# EAGLE design DMX (EAGLE 5.10)
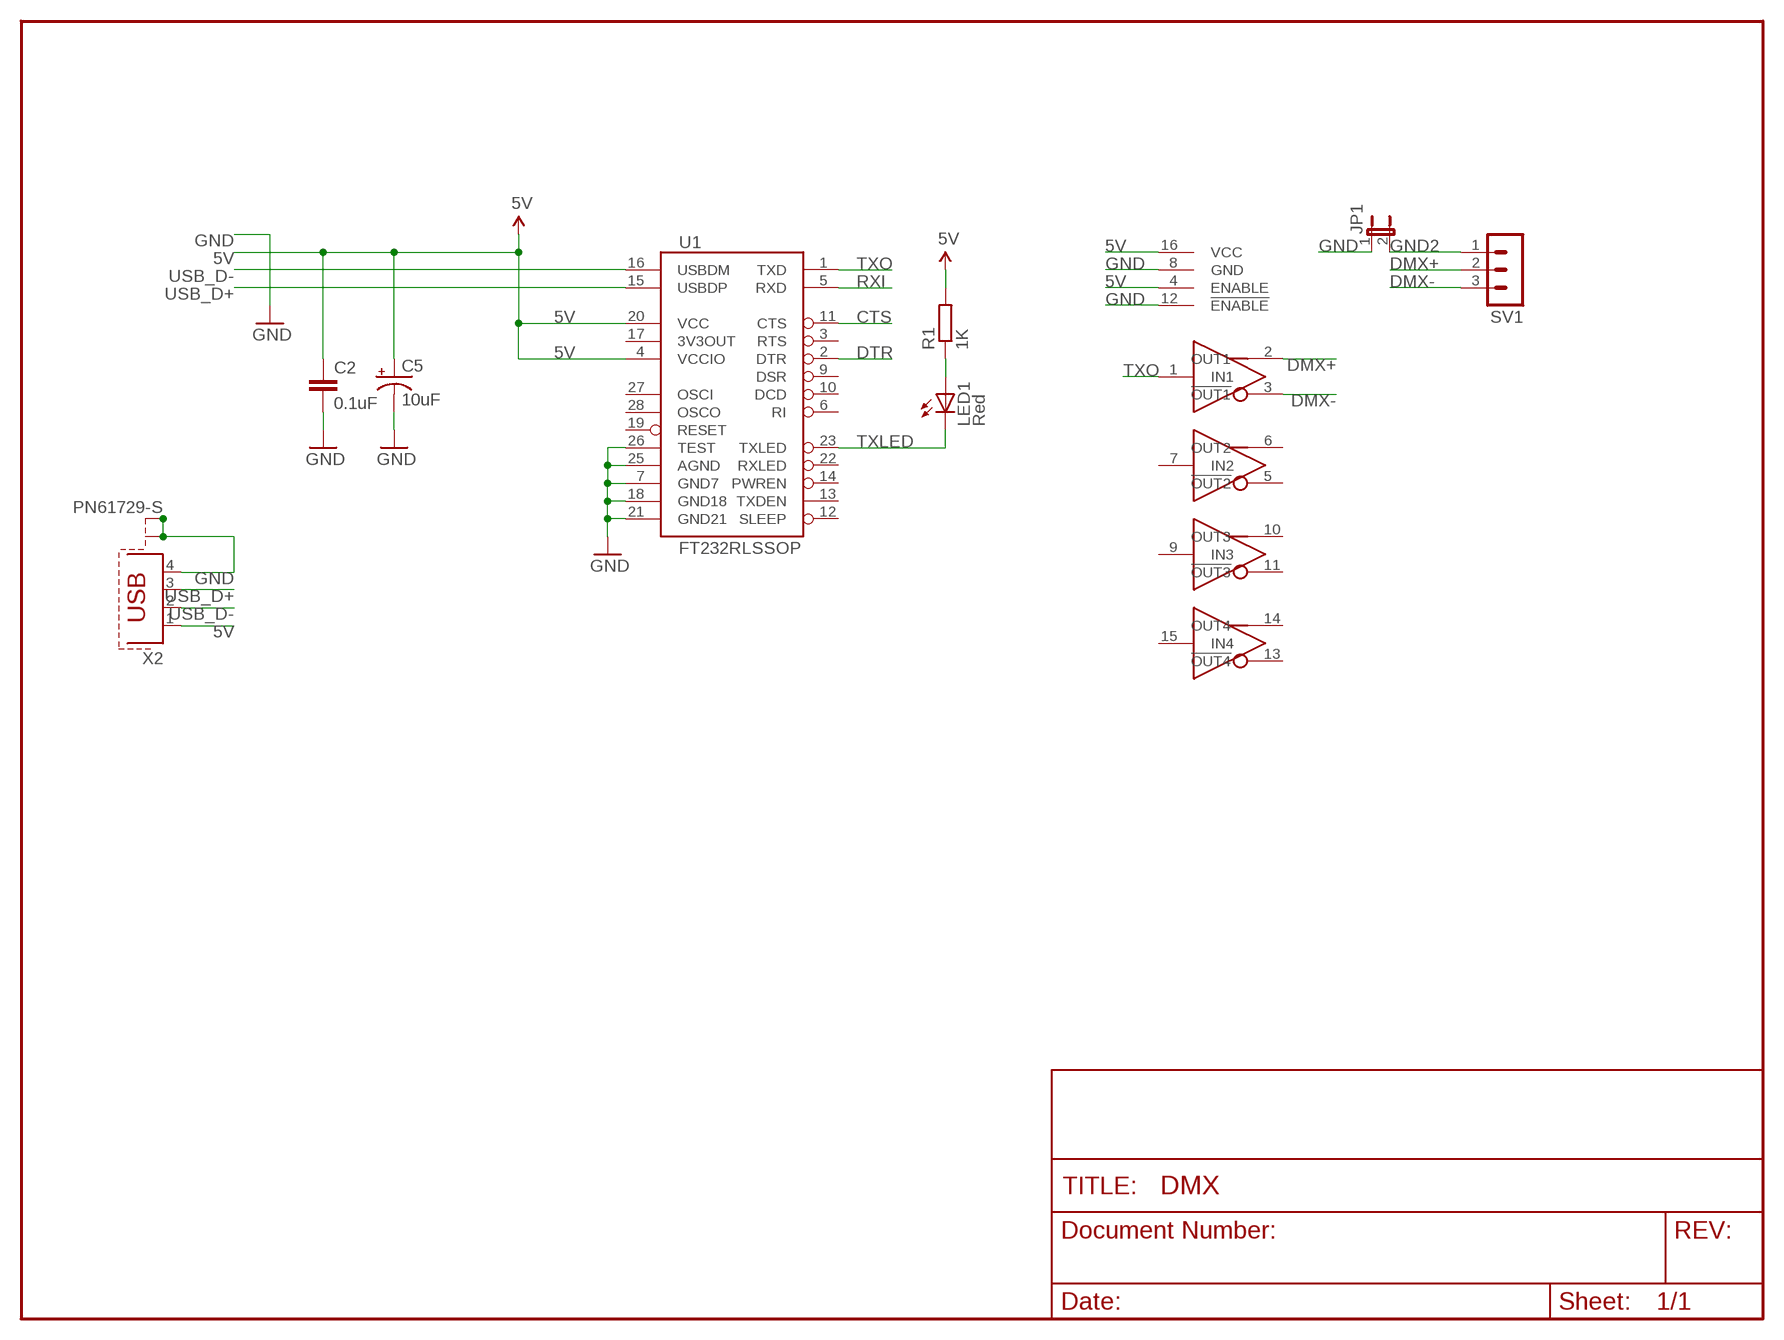
[diagram p0: schematic, sheet 1]

## Parts
C2  0.1uF  CAP0402-CAP  [0402-CAP]
C5  10uF  CAP_POL1206  [EIA3216]
JP1  JP1E  [JP1]
LED1  Red  LED3MM  [LED3MM]
R1  1K  R-EU_R0805  [R0805]
SV1  MA03-1  [MA03-1]
U1  FT232RLSSOP  [SSOP28DB]
U$5  26C31  [DIL16]
X2  PN61729-S  [PN61729-S]

## Nets
5V: C2.1 C5.A(+) R1.2 U1.4(VCCIO) U1.20(VCC) U$5.4(ENABLE) U$5.16(VCC) X2.1
CTS: U1.11(CTS)
DMX+: SV1.2 U$5.2(OUT1)
DMX-: SV1.3 U$5.3(!OUT1)
DTR: U1.2(DTR)
GND [power]: C2.2 C5.C(-) JP1.1 U1.7(GND7) U1.18(GND18) U1.21(GND21) U1.25(AGND) U1.26(TEST) U$5.8(GND) U$5.12(!ENABLE) X2.4 X2.S1 X2.S2
GND2: JP1.2 SV1.1
N$1: LED1.A R1.1
RXI: U1.5(RXD)
TXLED: LED1.K(C) U1.23(TXLED)
TXO: U1.1(TXD) U$5.1(IN1)
USB_D+: U1.15(USBDP) X2.3
USB_D-: U1.16(USBDM) X2.2
Unconnected: U1.3(RTS) U1.6(RI) U1.9(DSR) U1.10(DCD) U1.12(SLEEP) U1.13(TXDEN) U1.14(PWREN) U1.17(3V3OUT) U1.19(RESET) U1.22(RXLED) U1.27(OSCI) U1.28(OSCO) U$5.5(!OUT2) U$5.6(OUT2) U$5.7(IN2) U$5.9(IN3) U$5.10(OUT3) U$5.11(!OUT3) U$5.13(!OUT4) U$5.14(OUT4) U$5.15(IN4)

## Library data of the parts
C2 = SparkFun:CAP: Capacitor Standard 0603 ceramic capacitor, and 0.1" leaded capacitor.
C5 = SparkFun:CAP_POL: Capacitor Polarized These are standard SMD and PTH capacitors. Normally 10uF, 47uF, and 100uF in electrolytic and tantalum varieties. Always verify the external diameter of the through hole cap, it varies with capacity, voltage, and manufacturer. The EIA devices should be standard.
JP1 = jumper:JP1E: JUMPER
LED1 = led:LED: LED OSRAM: - CHIPLED LG R971, LG N971, LY N971, LG Q971, LY Q971, LO R971, LY R971 LH N974, LH R974 LS Q976, LO Q976, LY Q976 LO Q996 - Hyper CHIPLED LW Q18S LB Q993, LB Q99A, LB R99A - SideLED LS A670, LO A670, LY A670, LG A670, LP A670 LB A673, LV A673, LT A673, LW A673 LH A674 LY A675 LS A676, LA A676, LO A676, LY A676, LW A676 LS A679, LY A679, LG A679 - Hyper Micro SIDELED® LS Y876, LA Y876, LO Y876, LY Y876 LT Y87S - SmartLED LW L88C, LW L88S LB L89C, LB L89S, LG L890 LS L89K, LO L89K, LY L89K LS L896, LA L896, LO L896, LY L896 - TOPLED LS T670, LO T670, LY T670, LG T670, LP T670 LSG T670, LSP T670, LSY T670, LOP T670, LYG T670 LG T671, LOG T671, LSG T671 LB T673, LV T673, LT T673, LW T673 LH T674 LS T676, LA T676, LO T676, LY T676, LB T676, LH T676, LSB T676, LW T676 LB T67C, LV T67C, LT T67C, LS T67K, LO T67K, LY T67K, LW E67C LS E67B, LA E67B, LO E67B, LY E67B, LB E67C, LV E67C, LT E67C LW T67C LS T679, LY T679, LG T679 LS T770, LO T770, LY T770, LG T770, LP T770 LB T773, LV T773, LT T773, LW T773 LH T774 LS E675, LA E675, LY E675, LS T675 LS T776, LA T776, LO T776, LY T776, LB T776 LHGB T686 LT T68C, LB T68C - Hyper Mini TOPLED® LB M676 - Mini TOPLED Santana® LG M470 LS M47K, LO M47K, LY M47K Source: http://www.osram.convergy.de LUXEON: - LUMILED® LXK2-PW12-R00, LXK2-PW12-S00, LXK2-PW14-U00, LXK2-PW14-V00 LXK2-PM12-R00, LXK2-PM12-S00, LXK2-PM14-U00 LXK2-PE12-Q00, LXK2-PE12-R00, LXK2-PE12-S00, LXK2-PE14-T00, LXK2-PE14-U00 LXK2-PB12-K00, LXK2-PB12-L00, LXK2-PB12-M00, LXK2-PB14-N00, LXK2-PB14-P00, LXK2-PB14-Q00 LXK2-PR12-L00, LXK2-PR12-M00, LXK2-PR14-Q00, LXK2-PR14-R00 LXK2-PD12-Q00, LXK2-PD12-R00, LXK2-PD12-S00 LXK2-PH12-R00, LXK2-PH12-S00 LXK2-PL12-P00, LXK2-PL12-Q00, LXK2-PL12-R00 Source: www.luxeon.com KINGBRIGHT: KA-3528ASYC Source: www.kingbright.com
R1 = rcl:R-EU_: RESISTOR, European symbol
SV1 = con-lstb:MA03-1: PIN HEADER
U1 = SparkFun:FT232RL: USB UART FT232RL 4th Generation USB UART (USB <-> Serial) Controller. Spark Fun Electronics SKU : COM-00650
U$5 = jocki:26C31
X2 = con-berg:PN61729-S: BERG USB connector

## Net classes
0 default: width 0.203 mm
1 power: width 0.254 mm

## Board
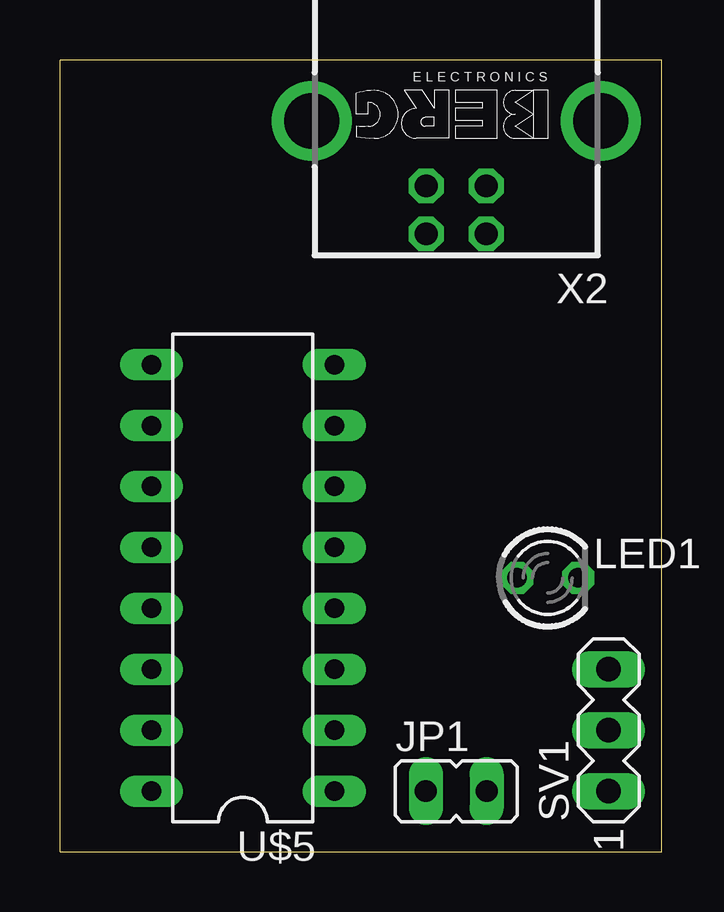
[diagram p1: board, top side]
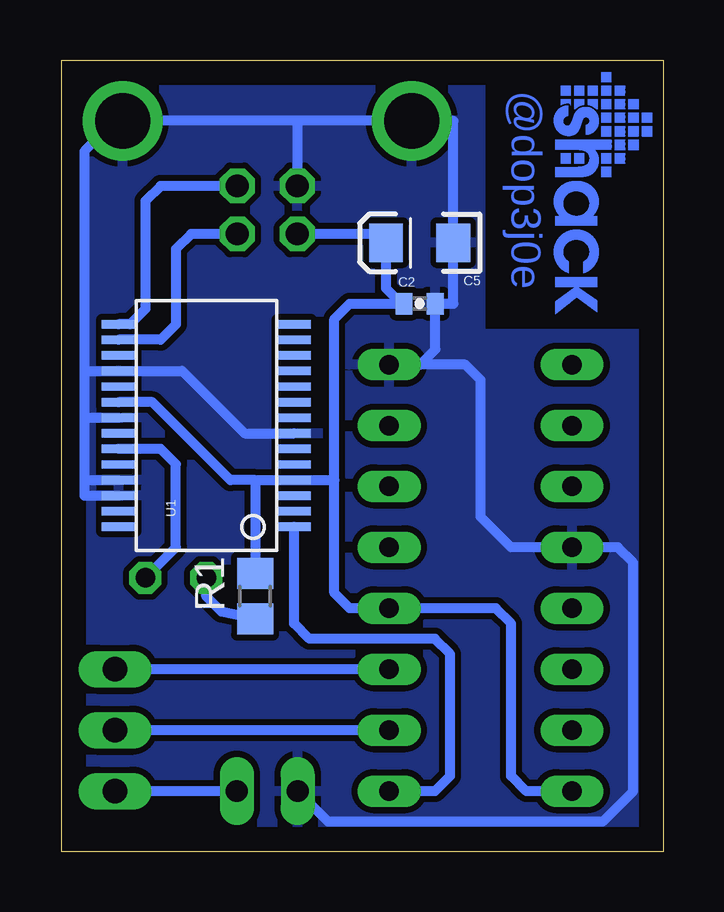
[diagram p2: board, bottom side, seen from below]

Size 25.07 x 33.02 mm. Coordinates in mm from the lower left corner, seen from the top.
Outline: 0,33.01 25.07,33.01 25.07,0 0,0 0,33.02
Copper layers (1*16): Top 0.035mm / dielectric 1.5mm / Bottom 0.035mm
Design rules "default": minimum track width 10mil, minimum drill 24mil, track to track 8mil, track to pad 8mil, pad to pad 8mil, via to via 8mil, smd to smd 8mil, copper to edge 40mil, drill to drill 8mil, minimum pad ring 10mil, minimum via ring 8mil, stop-mask expansion 4mil, vias tented up to drill 0mil, thermal gap 10mil

### Footprints (pad centres in the part's own frame; a part is rotated, then mirrored left to right if it is on the bottom)
0402-CAP = smd 0.7 x 0.9: 1 -0.65,0; 2 0.65,0
EIA3216 = smd 1.4 x 1.6: A 1.4,0; C -1.4,0
JP1 = drill 0.914 long: 1 0,-1.27; 2 0,1.27
LED3MM = drill 0.813 octagon: A -1.27,0; K 1.27,0
R0805 = smd 1.3 x 1.5: 1 -0.95,0; 2 0.95,0
MA03-1 = drill 1.016 long: 1 -2.54,0; 2 0,0; 3 2.54,0
SSOP28DB = smd 0.348 x 1.397: 1 -4.225,-3.656; 2 -3.575,-3.656; 3 -2.925,-3.656; 4 -2.275,-3.656; 5 -1.625,-3.656; 6 -0.975,-3.656; 7 -0.325,-3.656; 8 0.325,-3.656; 9 0.975,-3.656; 10 1.625,-3.656; 11 2.275,-3.656; 12 2.925,-3.656; 13 3.575,-3.656; 14 4.225,-3.656; 15 4.225,3.656; 16 3.575,3.656; 17 2.925,3.656; 18 2.275,3.656; 19 1.625,3.656; 20 0.975,3.656; 21 0.325,3.656; 22 -0.325,3.656; 23 -0.975,3.656; 24 -1.625,3.656; 25 -2.275,3.656; 26 -2.925,3.656; 27 -3.575,3.656; 28 -4.225,3.656
DIL16 = drill 0.813 long: 1 -7.62,-3.81; 2 -5.08,-3.81; 3 -2.54,-3.81; 4 0,-3.81; 5 2.54,-3.81; 6 5.08,-3.81; 7 7.62,-3.81; 8 10.16,-3.81; 9 10.16,3.81; 10 7.62,3.81; 11 5.08,3.81; 12 2.54,3.81; 13 0,3.81; 14 -2.54,3.81; 15 -5.08,3.81; 16 -7.62,3.81
PN61729-S = drill 0.95 octagon: 1 1.25,4.71; 2 -1.25,4.71; 3 -1.25,2.71; 4 1.25,2.71 | drill 2.3 pad 2.9 round: S1 -6.02,0; S2 6.02,0

### Placement (x,y rotation side)
C2  10.16,22.86 0 bottom
C5  10.16,25.4 180 bottom
JP1  16.51,2.54 270 top
LED1  20.32,11.43 0 top
R1  17.02,10.67 90 bottom
SV1  22.86,5.08 90 top
U1  19.05,17.78 90 bottom
U$2  [SHACK]  4.57,32.51 270 bottom
U$5  7.62,10.16 90 top
X2  16.51,30.48 180 top

### Tracks (layer width: path | path; a pad name or v marks a point on that pad's centre or on a via)
5V
  Bottom 0.406: X2.1 11.56,25.77 C5.A 11.56,23.5 10.93,22.86 | U$5.16 5.71,2.54 6.35,3.17 6.35,9.53 6.99,10.16 U$5.4 13.08,10.16 13.72,10.79 13.72,15.49 | 10.93,22.86 C2.1 | U1.20 21.3,18.75 18.05,15.51 17.02,15.51 17.02,15.49 | 10.93,22.86 13.08,22.86 13.72,22.23 13.72,15.49 | 17.02,15.49 R1.2 | 13.72,15.49 15.4,15.49 | 17.02,15.49 16.51,15.49 15.4,15.49 | 15.4,15.49 U1.4
DMX+
  Bottom 0.406: U$5.2 SV1.2
DMX-
  Bottom 0.406: U$5.3 SV1.3
GND
  Bottom 0.406: X2.S2 X2.S1 22.86,30.48 24.13,29.21 24.13,20.05 | X2.S2 15.26,30.48 X2.4 | X2.S2 8.76,30.48 C5.C 8.76,22.86 C2.2 9.51,20.95 10.14,20.32 U$5.8 8.26,20.32 7.62,19.68 7.62,13.97 6.35,12.7 U$5.12 1.91,12.7 1.27,12.06 1.27,2.54 2.54,1.27 13.97,1.27 JP1.1 | 24.13,20.05 24.13,18.11 | 24.13,18.11 U1.21 | U1.26 24.13,14.86 24.13,15.51 | 24.13,18.11 24.13,15.51 | 24.13,15.51 U1.25 | 24.13,20.05 U1.18 20.05,20.05 17.45,17.45 U1.7
  pour Bottom (isolate 0.254): 25.15,33.02 25.15,0 0,0 0,21.59 7.62,21.59 7.62,33.02
GND2
  Bottom 0.406: JP1.2 SV1.1
N$1
  Bottom 0.406: R1.1 18.41,10.02 19.05,10.65 LED1.A
TXLED
  Bottom 0.406: U1.23 20.95,16.8 20.32,16.17 20.32,12.7 LED1.K
TXO
  Bottom 0.406: U$5.1 9.53,2.54 8.89,3.17 8.89,8.26 9.53,8.89 14.76,8.89 15.39,9.53 U1.1
USB_D+
  Bottom 0.406: U1.15 22.23,22 21.59,22.64 21.59,27.14 20.95,27.77 X2.3
USB_D-
  Bottom 0.406: X2.2 19.68,25.77 20.32,25.14 20.32,21.99 20.95,21.36 U1.16

### Text on the board
Bottom: @dop3j0e